# EasyEDA Pro project MyTouchPad.eprj

# Schematic Schematic1
Create Date: 2024-04-01; Page Name: P1; Project Name: MyTouchPad; Schematic Name: Schematic1; Update Date: 2024-04-04; Company: 嘉立创EDA; Page Size: A4; Version: V1.0
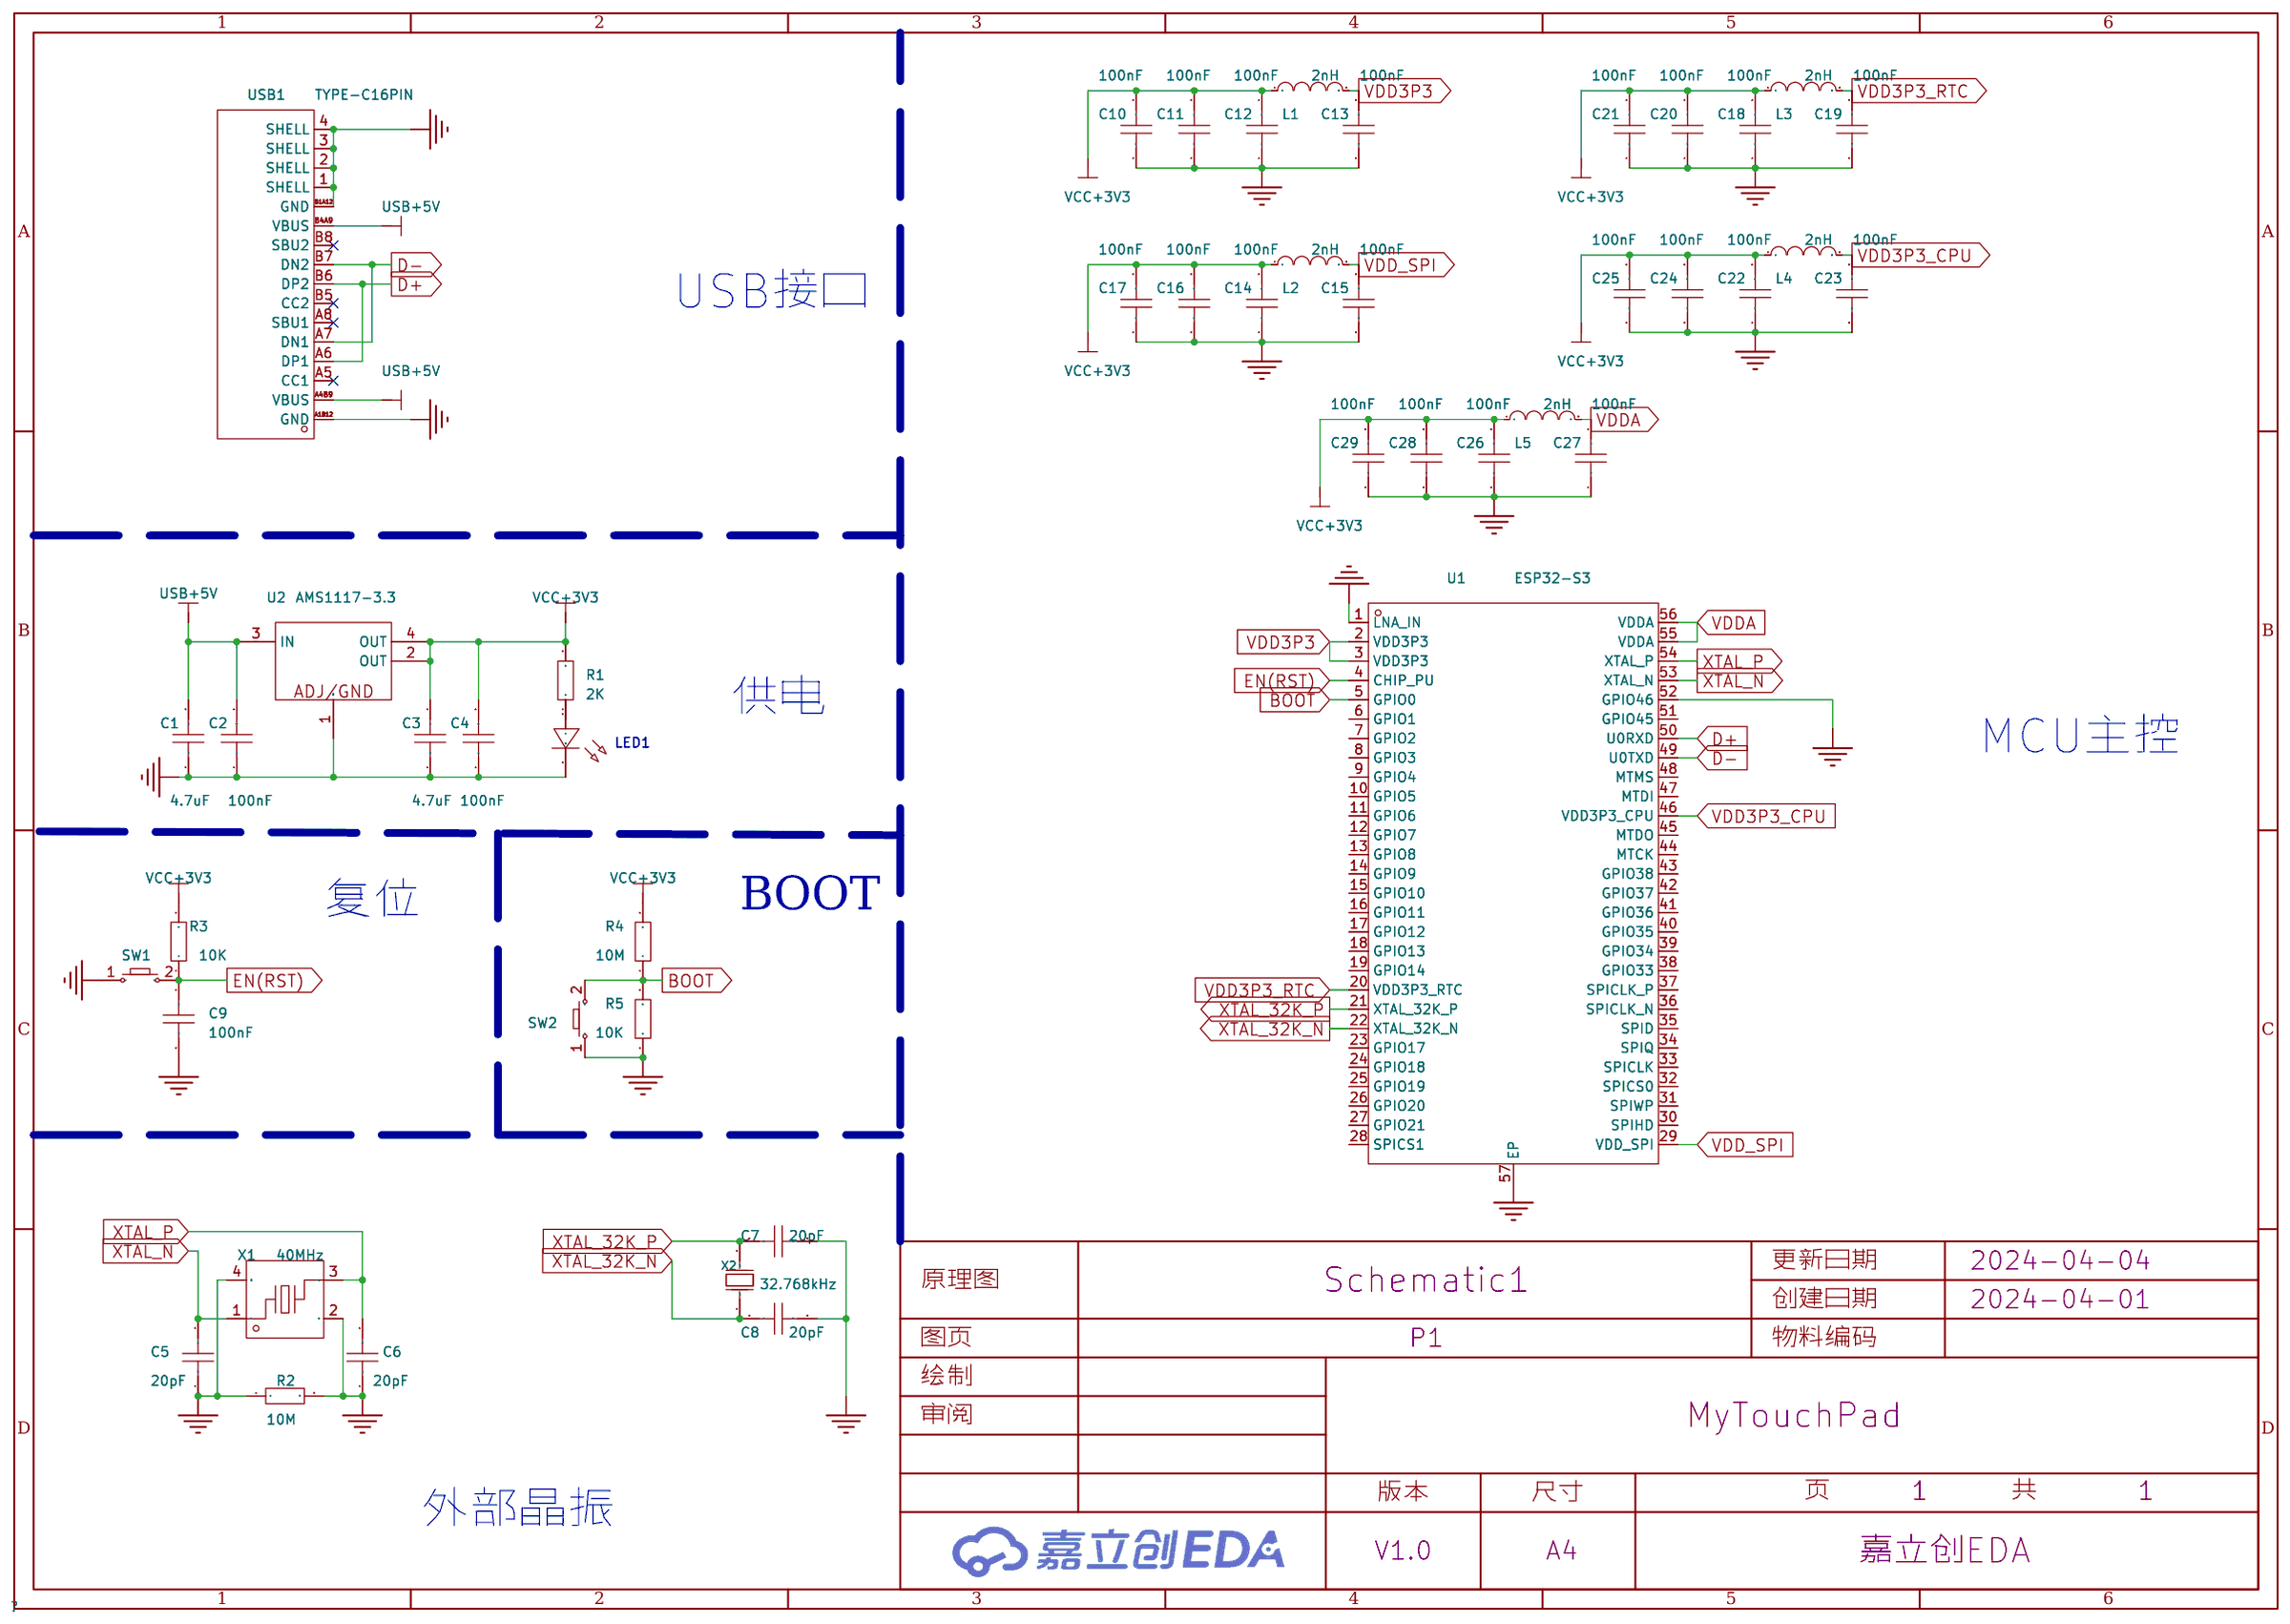
[diagram p0: schematic sheet]

## Parts
C1  4.7uF  [C0603]
C2  100nF  [C0603]
C3  4.7uF  [C0603]
C4  100nF  [C0603]
C5  20pF  [C0603]
C6  20pF  [C0603]
C7  20pF  [C0603]
C8  20pF  [C0603]
C9  100nF  [C0603]
C10  100nF  [C0603]
C11  100nF  [C0603]
C12  100nF  [C0603]
C13  100nF  [C0603]
C14  100nF  [C0603]
C15  100nF  [C0603]
C16  100nF  [C0603]
C17  100nF  [C0603]
C18  100nF  [C0603]
C19  100nF  [C0603]
C20  100nF  [C0603]
C21  100nF  [C0603]
C22  100nF  [C0603]
C23  100nF  [C0603]
C24  100nF  [C0603]
C25  100nF  [C0603]
C26  100nF  [C0603]
C27  100nF  [C0603]
C28  100nF  [C0603]
C29  100nF  [C0603]
L1  2nH  [L0603]
L2  2nH  [L0603]
L3  2nH  [L0603]
L4  2nH  [L0603]
L5  2nH  [L0603]
LED1  -  [LED_0603]
R1  2K  [R0603]
R2  10M  [R0603]
R3  10K  [R0603]
R4  10M  [R0603]
R5  10K  [R0603]
SW1  -  [Key_SMD_3x4x2]
SW2  -  [Key_SMD_3x4x2]
U1  ESP32-S3  [QFN-56_L7.0-W7.0-P0.40-TL-EP4.0]
U2  AMS1117-3.3  [SOT-223-3_L6.4-W3.5-P2.30-LS7.0-BR]
USB1  TYPE-C16PIN  [USB-C-SMD_TYPE-C16PIN]
X1  40MHz  [CRYSTAL-SMD_4P-L2.5-W2.0-BL]
X2  32.768kHz  [CRYSTAL-SMD_L3.2-W1.5-2]

## Library data of the parts
C1-C4 C7-C29 = CAP_0603: Supplier Footprint: 0603
C5 C6 = CC0603GRNPO9BN200: 容值:20pF;精度:±2%;额定电压:50V;材质(温度系数):NP0;; LCSC Part Name: 20pF ±2% 50V; Supplier Part: C325469; Manufacturer: YAGEO(国巨); Supplier Footprint: 0603; JLCPCB Part Class: 扩展库; Datasheet: https://atta.szlcsc.com/upload/public/pdf/source/20181031/C325469_5CAFEC33ED57CE51617E99770B64976D.pdf; Supplier: LCSC; Tolerance: ±2%; Voltage Rated: 50V; Temperature Coefficient: NP0
L1-L5 = L_0603
LED1 = LED_0603-G: Supplier Footprint: 0603
R1-R5 = Res_0603: Supplier Footprint: 0603
SW1 SW2 = Key_SMD_3x4x2: Supplier Footprint: SMD
U1 = ESP32-S3: LCSC Part Name: 支持2.4GHz WIFI和低功耗蓝牙的MCU SoC; Supplier Part: C2913192; Manufacturer: ESPRESSIF(乐鑫); Supplier Footprint: QFN-56-EP(7x7); JLCPCB Part Class: 扩展库; Datasheet: https://atta.szlcsc.com/upload/public/pdf/source/20231007/CDA236FFCB3F25B7D5220D2CA9867287.pdf; Supplier: LCSC
U2 = AMS1117-3.3_C2992570: Supplier Part: C2992570; Manufacturer: 国芯佳品; Supplier Footprint: SOT-223-3; JLCPCB Part Class: 扩展库; Datasheet: https://atta.szlcsc.com/upload/public/pdf/source/20220729/0D21C21EC310E4778671BF6BAE438640.pdf; Supplier: LCSC
USB1 = TYPE-C16PIN: 连接器类型:Type-C;标准:-;公母:母;端口数量:1;触点数量:16P;安装方式:卧贴;额定电流 - 电源:3A;工作温度范围:-40℃~+85℃;; LCSC Part Name: Type-C 母 卧贴; Supplier Part: C393939; Manufacturer: SHOU HAN(首韩); Supplier Footprint: SMD; Datasheet: https://atta.szlcsc.com/upload/public/pdf/source/20190521/C393939_7B9043D4CF1026AF443AB60D91FBCD5C.pdf; Supplier: LCSC; Connector Type: Type-C; Gender: 母; Number of Ports: 1; Number of Contacts: 16P; Mounting Style: 卧贴; Current Rating - Power (Max): 3A; Operating Temperature Range: -40℃~+85℃
X1 = S2240000091050JY: 晶振类型:贴片晶振;频率:40MHz;常温频差:±10ppm;外接负载电容:9pF;; LCSC Part Name: 40MHz ±10ppm 9pF; Supplier Part: C555632; Manufacturer: JGHC(晶光华); Supplier Footprint: SMD2520-4P; JLCPCB Part Class: 扩展库; Datasheet: https://atta.szlcsc.com/upload/public/pdf/source/20191012/C426971_E72B01839CFBB8D8B48FED2AC1315BE2.pdf; Supplier: LCSC; Crystal Type: 贴片晶振; Normal temperature Frequency Tolerance: ±10ppm; External load capacitor: 9pF; Equivalent Series Resistance (ESR): 50Ω; Operating Temperature: -40℃~+85℃
X2 = ABS07-32.768KHZ-6-T: 频率:32.768kHz;常温频差:±20ppm;外接负载电容:6pF;频率稳定度(全温):-;; LCSC Part Name: 32.768kHz ±20ppm 6pF; Supplier Part: C1985518; Manufacturer: ABRACON; Supplier Footprint: SMD3215-2P; JLCPCB Part Class: 扩展库; Datasheet: https://atta.szlcsc.com/upload/public/pdf/source/20180906/C276424_248D5DF2C4B6F2E5DB9021C295D5D581.pdf; Supplier: LCSC; Normal temperature Frequency Tolerance: ±20ppm; External load capacitor: 6pF; Equivalent Series Resistance (ESR): 70kΩ; Operating Temperature: -40℃~+85℃

## Nets
GND: C1.1 C2.1 C3.1 C4.1 C5.1 C6.1 C7.2 C8.2 C9.2 C10.1 C11.1 C12.1 C13.1 C14.1 C15.1 C16.1 C17.1 C18.1 C19.1 C20.1 C21.1 C22.1 C23.1 C24.1 C25.1 C26.1 C27.1 C28.1 C29.1 LED1.1(C) R2.1 R2.2 R5.1 SW1.1 SW2.1 U1.1(LNA_IN) U1.52(GPIO46) U1.57(EP) U2.1(ADJ/GND) USB1.1(SHELL) USB1.2(SHELL) USB1.3(SHELL) USB1.4(SHELL) USB1.A1B12(GND) USB1.B1A12(GND) X1.2(GND) X1.4(GND)
VCC+3V3: C3.2 C4.2 C10.2 C11.2 C12.2 C14.2 C16.2 C17.2 C18.2 C20.2 C21.2 C22.2 C24.2 C25.2 C26.2 C28.2 C29.2 L1.1 L2.1 L3.1 L4.1 L5.1 R1.2 R3.2 R4.2 U2.2(OUT) U2.4(OUT)
VDD3P3: C13.2 L1.2 U1.2(VDD3P3) U1.3(VDD3P3)
VDD3P3_CPU: C23.2 L4.2 U1.46(VDD3P3_CPU)
VDD3P3_RTC: C19.2 L3.2 U1.20(VDD3P3_RTC)
VDD_SPI: C15.2 L2.2 U1.29(VDD_SPI)
VDDA: C27.2 L5.2 U1.55(VDDA) U1.56(VDDA)
BOOT: R4.1 R5.2 SW2.2 U1.5(GPIO0)
D+: U1.50(U0RXD) USB1.A6(DP1) USB1.B6(DP2)
D-: U1.49(U0TXD) USB1.A7(DN1) USB1.B7(DN2)
EN(RST): C9.1 R3.1 SW1.2 U1.4(CHIP_PU)
USB+5V: C1.2 C2.2 U2.3(IN) USB1.A4B9(VBUS) USB1.B4A9(VBUS)
XTAL_32K_N: C8.1 U1.22(XTAL_32K_N) X2.1(OSC1)
XTAL_32K_P: C7.1 U1.21(XTAL_32K_P) X2.2(OSC2)
XTAL_N: C5.2 U1.53(XTAL_N) X1.1
XTAL_P: C6.2 U1.54(XTAL_P) X1.3
Net-(LED1-2): LED1.2(A) R1.1

Not connected (* = marked no-connect by the designer): U1 6(GPIO1) 7(GPIO2) 8(GPIO3) 9(GPIO4) 10(GPIO5) 11(GPIO6) 12(GPIO7) 13(GPIO8) 14(GPIO9) 15(GPIO10) 16(GPIO11) 17(GPIO12) 18(GPIO13) 19(GPIO14) 23(GPIO17) 24(GPIO18) 25(GPIO19) 26(GPIO20) 27(GPIO21) 28(SPICS1) 30(SPIHD) 31(SPIWP) 32(SPICS0) 33(SPICLK) 34(SPIQ) 35(SPID) 36(SPICLK_N) 37(SPICLK_P) 38(GPIO33) 39(GPIO34) 40(GPIO35) 41(GPIO36) 42(GPIO37) 43(GPIO38) 44(MTCK) 45(MTDO) 47(MTDI) 48(MTMS) 51(GPIO45); USB1 A5(CC1)* A8(SBU1)* B5(CC2)* B8(SBU2)*

## Notes on the sheet
- USB接口
- 供电
- MCU主控
- 复位
- BOOT
- 外部晶振
